# EAGLE design xmega (EAGLE 5.11)
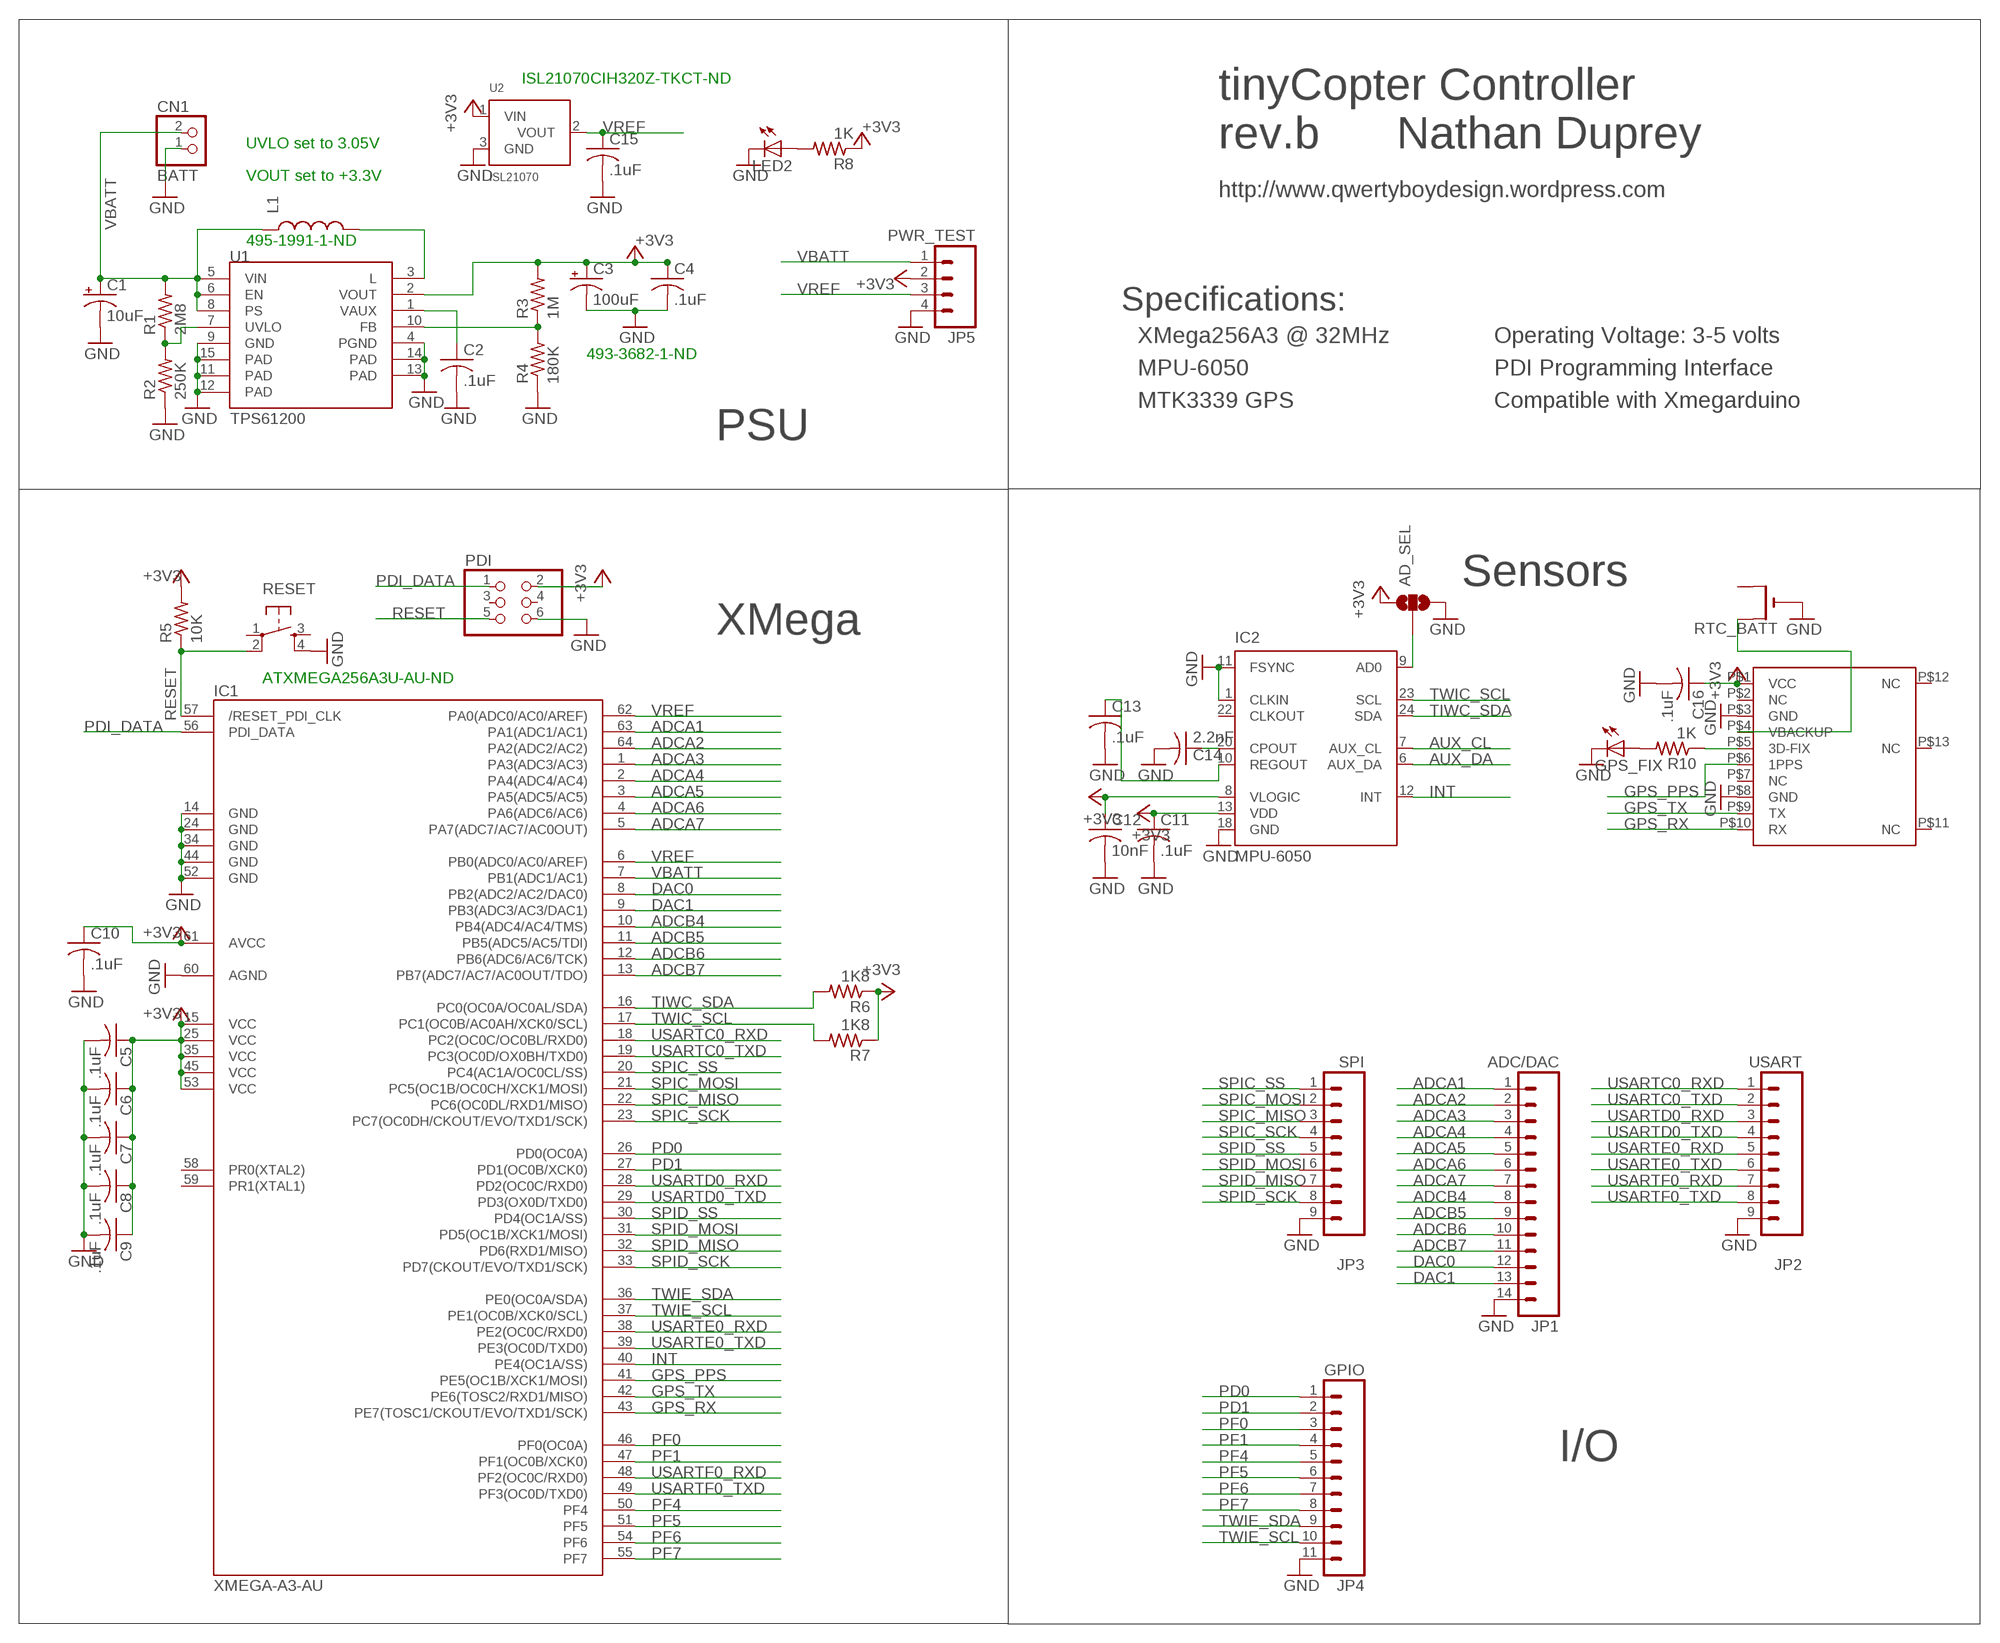
[diagram p0: schematic, sheet 1]

## Parts
AD_SEL  SOLDERJUMPER_2WAY-OLDT  [SJ_2]
C1  10uF  FS_SERIES  [FS_SERIES]
C2  .1uF  C-USC0603  [C0603]
C3  100uF  FS_SERIES  [FS_SERIES]
C4  .1uF  C-USC0603  [C0603]
C5  .1uF  C-USC0603  [C0603]
C6  .1uF  C-USC0603  [C0603]
C7  .1uF  C-USC0603  [C0603]
C8  .1uF  C-USC0603  [C0603]
C9  .1uF  C-USC0603  [C0603]
C10  .1uF  C-USC0603  [C0603]
C11  .1uF  C-USC0603  [C0603]
C12  10nF  C-USC0603  [C0603]
C13  .1uF  C-USC0603  [C0603]
C14  2.2nF  C-USC0603  [C0603]
C15  .1uF  C-USC0603  [C0603]
C16  .1uF  C-USC0603  [C0603]
CN1  BATT  JST_2PIN-THM  [JST-PH-2-THM]
GPS  GPS_FGPMMOPA6C  [FGPMMOPA6C]
GPS_FIX  LEDCHIPLED_0805  [CHIPLED_0805]
IC1  XMEGA-A3-AU  [TQFP64_14X14MM]
IC2  MPU-6050  [QFN-24]
JP1  ADC/DAC  M14LOCK  [1X14_LOCK]
JP2  USART  M09LOCK  [1X09_LOCK]
JP3  SPI  M09LOCK  [1X09_LOCK]
JP4  GPIO  M11LOCK  [1X11_LOCK]
JP5  PWR_TEST  M04LOCK  [1X04_LOCK]
L1  INDUCTOR-B82462G  [B82462G]
LED2  LEDCHIPLED_0805  [CHIPLED_0805]
PDI  PINHD-2X3  [2X03]
R1  2M8  R-US_R0603  [R0603]
R2  250K  R-US_R0603  [R0603]
R3  1M  R-US_R0603  [R0603]
R4  180K  R-US_R0603  [R0603]
R5  10K  R-US_R0603  [R0603]
R6  1K8  R-US_R0603  [R0603]
R7  1K8  R-US_R0603  [R0603]
R8  1K  R-US_R0603  [R0603]
R10  1K  R-US_R0603  [R0603]
RESET  TAC_SWITCHSMD  [TACTILE_SWITCH_SMD]
RTC_BATT  CR1220SMT  [CR1220-SMD]
U1  TPS61200  [QFN-10_PAD]
U2  ISL21070  [SOT-23]

## Nets
+3V3: AD_SEL.1 C3.+ C4.1 C5.1 C6.1 C7.1 C8.1 C9.1 C10.1 C11.1 C12.1 C16.1 GPS.P$1(VCC) IC1.15(VCC1) IC1.25(VCC2) IC1.35(VCC3) IC1.45(VCC4) IC1.53(VCC5) IC1.61(AVCC) IC2.8(VLOGIC) IC2.13(VDD) JP5.2 PDI.2 R3.2 R5.2 R6.1 R7.1 R8.1 U1.2(VOUT) U2.1(VIN)
ADCA1: IC1.63(PA1(ADC1/AC1)) JP1.1
ADCA2: IC1.64(PA2(ADC2/AC2)) JP1.2
ADCA3: IC1.1(PA3(ADC3/AC3)) JP1.3
ADCA4: IC1.2(PA4(ADC4/AC4)) JP1.4
ADCA5: IC1.3(PA5(ADC5/AC5)) JP1.5
ADCA6: IC1.4(PA6(ADC6/AC6)) JP1.6
ADCA7: IC1.5(PA7(ADC7/AC7/AC0OUT)) JP1.7
ADCB4: IC1.10(PB4(ADC4/AC4/TMS)) JP1.8
ADCB5: IC1.11(PB5(ADC5/AC5/TDI)) JP1.9
ADCB6: IC1.12(PB6(ADC6/AC6/TCK)) JP1.10
ADCB7: IC1.13(PB7(ADC7/AC7/AC0OUT/TDO)) JP1.11
AUX_CL: IC2.7(AUX_CL)
AUX_DA: IC2.6(AUX_DA)
DAC0: IC1.8(PB2(ADC2/AC2/DAC0)) JP1.12
DAC1: IC1.9(PB3(ADC3/AC3/DAC1)) JP1.13
GND: AD_SEL.3 C1.- C2.2 C3.- C4.2 C5.2 C6.2 C7.2 C8.2 C9.2 C10.2 C11.2 C12.2 C13.2 C14.2 C15.2 C16.2 CN1.1 GPS.P$3(GND) GPS.P$8(GND) GPS_FIX.C IC1.14(GND1) IC1.24(GND2) IC1.34(GND3) IC1.44(GND4) IC1.52(GND5) IC1.60(AGND) IC2.1(CLKIN) IC2.11(FSYNC) IC2.18(GND) JP1.14 JP2.9 JP3.9 JP4.11 JP5.4 LED2.C PDI.6 R2.1 R4.1 RESET.4 RTC_BATT.- U1.4(PGND) U1.9(GND) U1.11(PAD) U1.12(PAD) U1.13(PAD) U1.14(PAD) U1.15(PAD) U2.3(GND)
GPS_PPS: GPS.P$6(1PPS) IC1.41(PE5(OC1B/XCK1/MOSI))
GPS_RX: GPS.P$10(RX) IC1.43(PE7(TOSC1/CKOUT/EVO/TXD1/SCK))
GPS_TX: GPS.P$9(TX) IC1.42(PE6(TOSC2/RXD1/MISO))
INT: IC1.40(PE4(OC1A/SS)) IC2.12(INT)
N$1: L1.P$2 U1.3(L)
N$2: R1.1 R2.2 U1.7(UVLO)
N$3: C2.1 U1.1(VAUX)
N$4: R3.1 R4.2 U1.10(FB)
N$5: GPS.P$5(3D-FIX) R10.1
N$6: AD_SEL.2 IC2.9(AD0)
N$7: GPS_FIX.A R10.2
N$8: LED2.A R8.2
N$9: C14.1 IC2.20(CPOUT)
N$10: C13.1 IC2.10(REGOUT)
N$11: GPS.P$4(VBACKUP) RTC_BATT.+$1(+)
PD0: IC1.26(PD0(OC0A)) JP4.1
PD1: IC1.27(PD1(OC0B/XCK0)) JP4.2
PDI_DATA: IC1.56(PDI_DATA) PDI.1
PF0: IC1.46(PF0(OC0A)) JP4.3
PF1: IC1.47(PF1(OC0B/XCK0)) JP4.4
PF4: IC1.50(PF4) JP4.5
PF5: IC1.51(PF5) JP4.6
PF6: IC1.54(PF6) JP4.7
PF7: IC1.55(PF7) JP4.8
RESET: IC1.57(/RESET_PDI_CLK) PDI.5 R5.1 RESET.2
SPIC_MISO: IC1.22(PC6(OC0DL/RXD1/MISO)) JP3.3
SPIC_MOSI: IC1.21(PC5(OC1B/OC0CH/XCK1/MOSI)) JP3.2
SPIC_SCK: IC1.23(PC7(OC0DH/CKOUT/EVO/TXD1/SCK)) JP3.4
SPIC_SS: IC1.20(PC4(AC1A/OC0CL/SS)) JP3.1
SPID_MISO: IC1.32(PD6(RXD1/MISO)) JP3.7
SPID_MOSI: IC1.31(PD5(OC1B/XCK1/MOSI)) JP3.6
SPID_SCK: IC1.33(PD7(CKOUT/EVO/TXD1/SCK)) JP3.8
SPID_SS: IC1.30(PD4(OC1A/SS)) JP3.5
TIWC_SDA: IC1.16(PC0(OC0A/OC0AL/SDA)) IC2.24(SDA) R6.2
TWIC_SCL: IC1.17(PC1(OC0B/AC0AH/XCK0/SCL)) IC2.23(SCL) R7.2
TWIE_SCL: IC1.37(PE1(OC0B/XCK0/SCL)) JP4.10
TWIE_SDA: IC1.36(PE0(OC0A/SDA)) JP4.9
USARTC0_RXD: IC1.18(PC2(OC0C/OC0BL/RXD0)) JP2.1
USARTC0_TXD: IC1.19(PC3(OC0D/OX0BH/TXD0)) JP2.2
USARTD0_RXD: IC1.28(PD2(OC0C/RXD0)) JP2.3
USARTD0_TXD: IC1.29(PD3(OX0D/TXD0)) JP2.4
USARTE0_RXD: IC1.38(PE2(OC0C/RXD0)) JP2.5
USARTE0_TXD: IC1.39(PE3(OC0D/TXD0)) JP2.6
USARTF0_RXD: IC1.48(PF2(OC0C/RXD0)) JP2.7
USARTF0_TXD: IC1.49(PF3(OC0D/TXD0)) JP2.8
VBATT: C1.+ CN1.2 IC1.7(PB1(ADC1/AC1)) JP5.1 L1.P$1 R1.2 U1.5(VIN) U1.6(EN) U1.8(PS)
VREF: C15.1 IC1.6(PB0(ADC0/AC0/AREF)) IC1.62(PA0(ADC0/AC0/AREF)) JP5.3 U2.2(VOUT)
Unconnected: GPS.P$2(NC) GPS.P$7(NC) GPS.P$11(NC) GPS.P$12(NC) GPS.P$13(NC) IC1.58(PR0(XTAL2)) IC1.59(PR1(XTAL1)) IC2.22(CLKOUT) PDI.3 PDI.4 RESET.1 RESET.3 RTC_BATT.+$2(+1)

## Notes on the sheet
- ISL21070CIH320Z-TKCT-ND
- tinyCopter Controller
- UVLO set to 3.05V | rev.b | Nathan Duprey
- VOUT set to +3.3V
- http://www.qwertyboydesign.wordpress.com
- 495-1991-1-ND
- Specifications:
- XMega256A3 @ 32MHz | Operating Voltage: 3-5 volts
- 493-3682-1-ND
- MPU-6050 | PDI Programming Interface
- MTK3339 GPS | Compatible with Xmegarduino
- PSU
- Sensors
- XMega
- ATXMEGA256A3U-AU-ND
- I/O

## Library data of the parts
AD_SEL = SparkFun:SOLDERJUMPER_2WAY-OLD: Solder Jumper 2 way solder jumper
C1 C3 = adafruit:FS_SERIES
C2 C4-C16 = adafruit:C-US: CAPACITOR, American symbol
CN1 = adafruit:JST_2PIN: JST 2-Pin Connectors of various flavors SMT-RA (S2B-PH-SM4) 4UConnector #17311 SMT (B2B-PH-SM4) THM-RA (S2B-PH) THM (B2B-PH)
GPS = adafruit:GPS_FGPMMOPA6C: FGPMMOPA6C 16x16 GPS Module NMEA Sentences: GGA, GSA, GSV, RMC, VTG
GPS_FIX LED2 = adafruit:LED: LED OSRAM: - CHIPLED LG R971, LG N971, LY N971, LG Q971, LY Q971, LO R971, LY R971 LH N974, LH R974 LS Q976, LO Q976, LY Q976 LO Q996 - Hyper CHIPLED LW Q18S LB Q993, LB Q99A, LB R99A - SideLED LS A670, LO A670, LY A670, LG A670, LP A670 LB A673, LV A673, LT A673, LW A673 LH A674 LY A675 LS A676, LA A676, LO A676, LY A676, LW A676 LS A679, LY A679, LG A679 - Hyper Micro SIDELED® LS Y876, LA Y876, LO Y876, LY Y876 LT Y87S - SmartLED LW L88C, LW L88S LB L89C, LB L89S, LG L890 LS L89K, LO L89K, LY L89K LS L896, LA L896, LO L896, LY L896 - TOPLED LS T670, LO T670, LY T670, LG T670, LP T670 LSG T670, LSP T670, LSY T670, LOP T670, LYG T670 LG T671, LOG T671, LSG T671 LB T673, LV T673, LT T673, LW T673 LH T674 LS T676, LA T676, LO T676, LY T676, LB T676, LH T676, LSB T676, LW T676 LB T67C, LV T67C, LT T67C, LS T67K, LO T67K, LY T67K, LW E67C LS E67B, LA E67B, LO E67B, LY E67B, LB E67C, LV E67C, LT E67C LW T67C LS T679, LY T679, LG T679 LS T770, LO T770, LY T770, LG T770, LP T770 LB T773, LV T773, LT T773, LW T773 LH T774 LS E675, LA E675, LY E675, LS T675 LS T776, LA T776, LO T776, LY T776, LB T776 LHGB T686 LT T68C, LB T68C - Hyper Mini TOPLED® LB M676 - Mini TOPLED Santana® LG M470 LS M47K, LO M47K, LY M47K Source: http://www.osram.convergy.de/
IC1 = SparkFun:XMEGA-A3: Atmel's 8/16-bit AVR XMEGA A3 Microcontroller - ATxmega256A3, etc.
IC2 = InvenSense:MPU-6050: MPU-6050 The MPU-60X0 has an embedded 3-axis MEMS gyroscope, a 3-axis MEMS accelerometer, and a Digital Motion Processor? (DMP?) hardware accelerator engine with an auxiliary I2C port that interfaces to 3rd party digital sensors such as magnetometers. Source: MPU-60X0 Product Specification <http://dlnmh9ip6v2uc.cloudfront.net/datasheets/Components/General%20IC/PS-MPU-6000A.pdf>
JP1 = SparkFun:M14: Header 14 Standard 14-pin 0.1" header. Use with straight break away headers (SKU : PRT-00116), right angle break away headers (PRT-00553), swiss pins (PRT-00743), machine pins (PRT-00117), and female headers (PRT-00115).
JP2 JP3 = SparkFun:M09: Header 9 Standard 9-pin 0.1" header. Use with straight break away headers (SKU : PRT-00116), right angle break away headers (PRT-00553), swiss pins (PRT-00743), machine pins (PRT-00117), and female headers (PRT-00115).
JP4 = SparkFun:M11: Header 11 Standard 11-pin 0.1" header. Use with straight break away headers (SKU : PRT-00116), right angle break away headers (PRT-00553), swiss pins (PRT-00743), machine pins (PRT-00117), and female headers (PRT-00115).
JP5 = SparkFun:M04: Header 4 Standard 4-pin 0.1" header. Use with straight break away headers (SKU : PRT-00116), right angle break away headers (PRT-00553), swiss pins (PRT-00743), machine pins (PRT-00117), and female headers (PRT-00115). Molex polarized connector foot print use with SKU : PRT-08231 with associated crimp pins and housings. 1MM SMD Version SKU: PRT-10208
L1 = SparkFun:INDUCTOR: Inductors Basic Inductor/Choke - 0603 and 1206. Footprints are not proven and vary greatly between part numbers.
PDI = SparkFun:PINHD-2X3: PIN HEADER
R1-R8 R10 = adafruit:R-US_: RESISTOR, American symbol
RESET = SparkFun:TAC_SWITCH: Momentary Switch Button commonly used for reset or general input. Spark Fun Electronics SKU : COM-00097
RTC_BATT = adafruit:CR1220: CR1216/CR1220/CR1225 12mm 3V lithium coin cell Great for battery packup. Both SMT and THM holders. Note the THM package has the ground pads on both sides of the PCB so that the masks are the same - this reduces the cost
U1 = SparkFun:TPS61200: DC to DC Booster
U2 = intersil:ISL21070

## Board
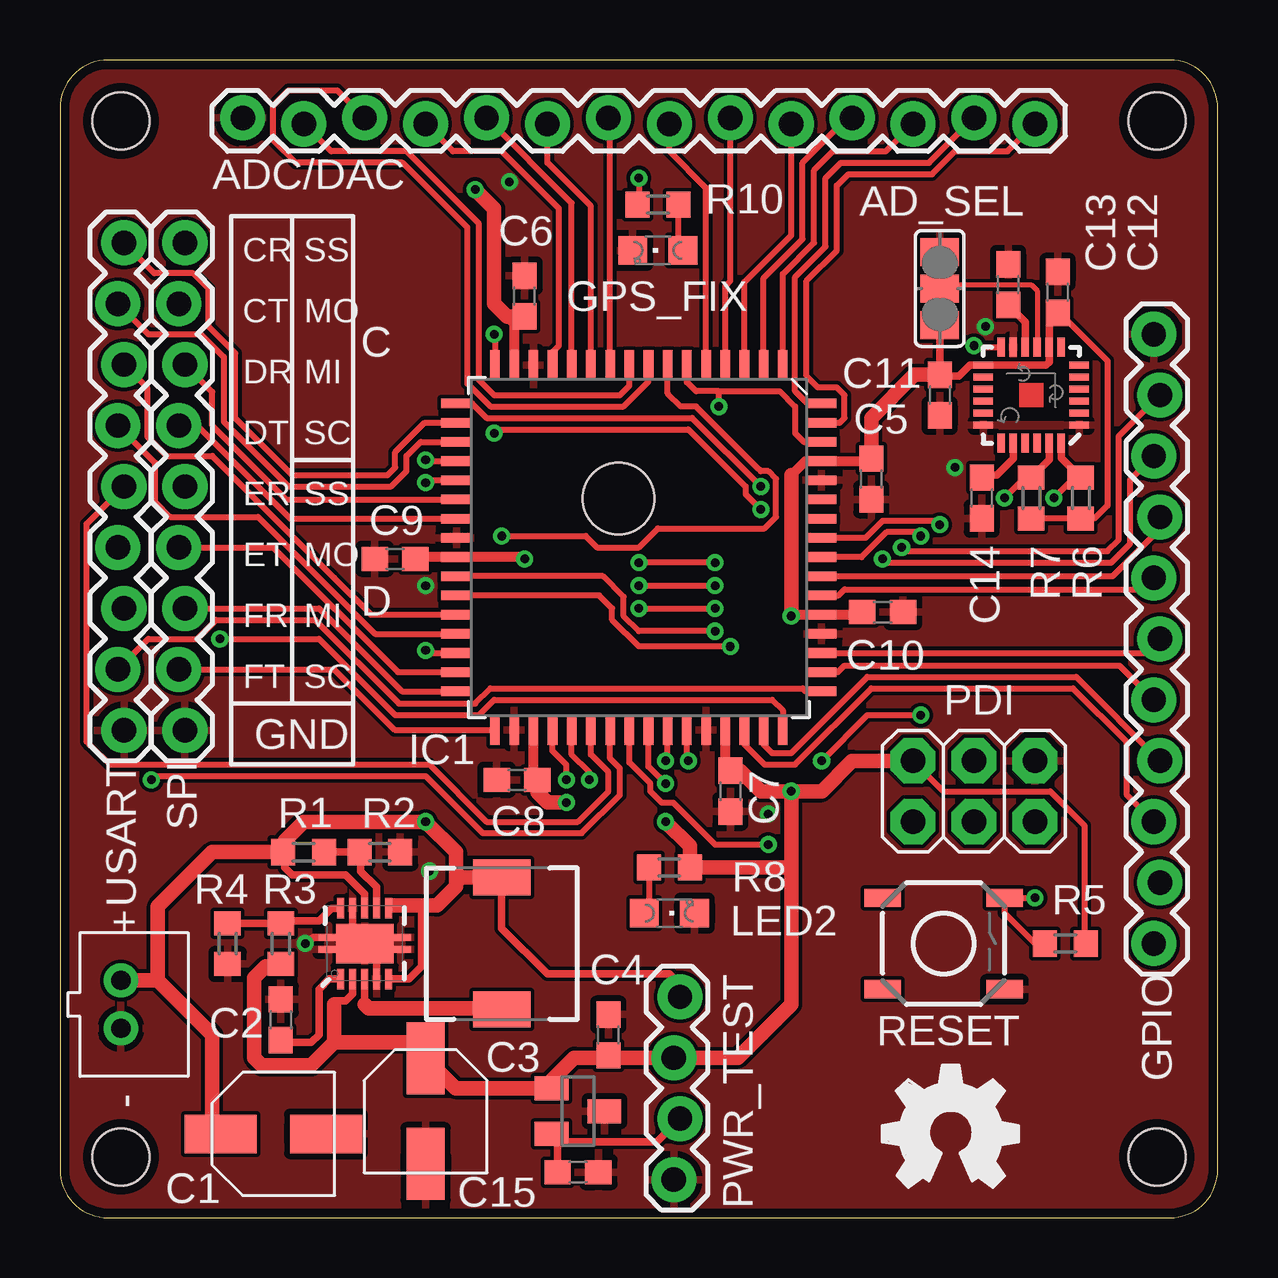
[diagram p1: board, top side]
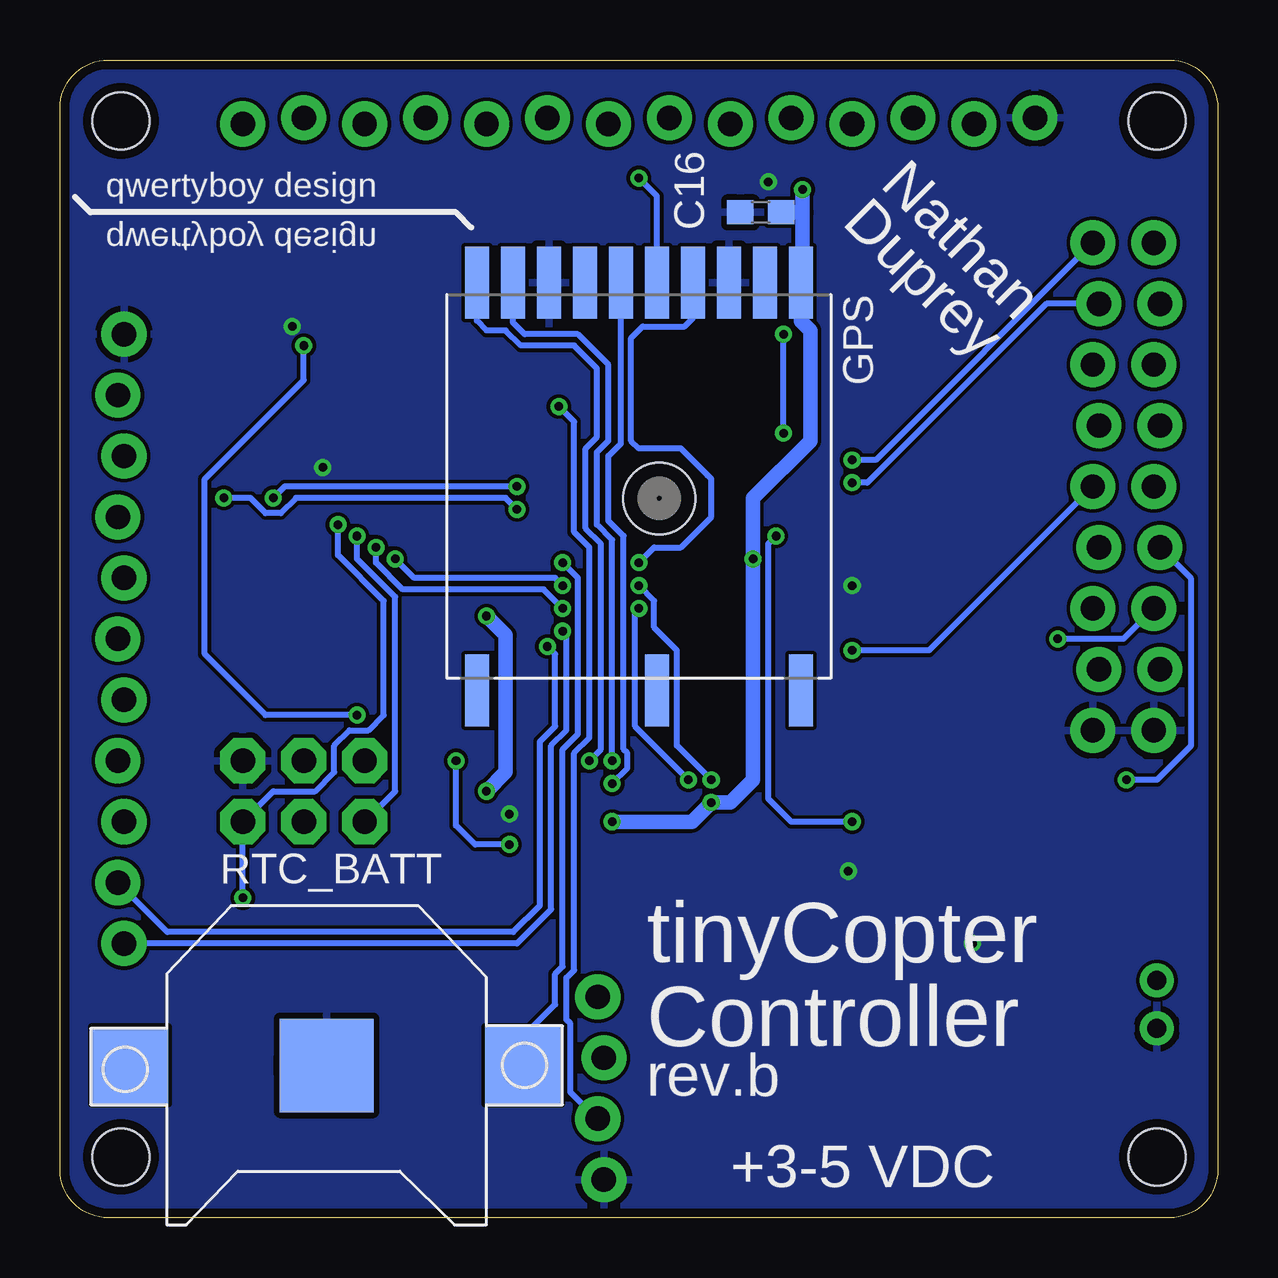
[diagram p2: board, bottom side, seen from below]

Size 48.26 x 48.26 mm. Coordinates in mm from the lower left corner, seen from the top.
Outline: 2,48.26 arc90 0,46.26 0,2 arc90 2,0 46.26,0 arc90 48.26,2 48.26,46.26 arc90 46.26,48.26 2,48.26
Copper layers (1*16): Top 0.0356mm / dielectric 1.5011mm / Bottom 0.0356mm
Design rules "LaenPCBOrder *": minimum track width 6mil, minimum drill 13mil, track to track 6mil, track to pad 6mil, pad to pad 6mil, via to via 6mil, smd to smd 6mil, copper to edge 15mil, drill to drill 6mil, minimum pad ring 7mil, minimum via ring 7mil, stop-mask expansion 4mil, vias tented up to drill 15mil, thermal gap 10mil
Holes 2.38 mm at 2.54,2.54 45.72,2.54 2.54,45.72 45.72,45.72
tRestrict: 46 lines
bRestrict: 15 lines

### Footprints (pad centres in the part's own frame; a part is rotated, then mirrored left to right if it is on the bottom)
SJ_2 = smd 1.168 x 1.6: 1 -1.524,0; 2 0,0; 3 1.524,0
FS_SERIES = smd 3 x 1.6: + 2.2,0; - -2.2,0
C0603 = smd 1.1 x 1: 1 -0.85,0; 2 0.85,0
JST-PH-2-THM = drill 0.8 pad 1.422 round: 1 1,0; 2 -1,0
FGPMMOPA6C = smd 3 x 1: P$1 -8.5,6.75; P$2 -8.5,5.25; P$3 -8.5,3.75; P$4 -8.5,2.25; P$5 -8.5,0.75; P$6 -8.5,-0.75; P$7 -8.5,-2.25; P$8 -8.5,-3.75; P$9 -8.5,-5.25; P$10 -8.5,-6.75; P$11 8.5,-6.75; P$12 8.5,0.75; P$13 8.5,6.75 | hole 3: 0.5,0.85
CHIPLED_0805 = smd 1.2 x 1.2: A 0,-1.05; C 0,1.05
TQFP64_14X14MM = smd 0.4 x 1.27: 1 -6,-7.6; 2 -5.2,-7.6; 3 -4.4,-7.6; 4 -3.6,-7.6; 5 -2.8,-7.6; 6 -2,-7.6; 7 -1.2,-7.6; 8 -0.4,-7.6; 9 0.4,-7.6; 10 1.2,-7.6; 11 2,-7.6; 12 2.8,-7.6; 13 3.6,-7.6; 14 4.4,-7.6; 15 5.2,-7.6; 16 6,-7.6; 33 6,7.6; 34 5.2,7.6; 35 4.4,7.6; 36 3.6,7.6; 37 2.8,7.6; 38 2,7.6; 39 1.2,7.6; 40 0.4,7.6; 41 -0.4,7.6; 42 -1.2,7.6; 43 -2,7.6; 44 -2.8,7.6; 45 -3.6,7.6; 46 -4.4,7.6; 47 -5.2,7.6; 48 -6,7.6 | smd 1.27 x 0.4: 17 7.6,-6; 18 7.6,-5.2; 19 7.6,-4.4; 20 7.6,-3.6; 21 7.6,-2.8; 22 7.6,-2; 23 7.6,-1.2; 24 7.6,-0.4; 25 7.6,0.4; 26 7.6,1.2; 27 7.6,2; 28 7.6,2.8; 29 7.6,3.6; 30 7.6,4.4; 31 7.6,5.2; 32 7.6,6; 49 -7.6,6; 50 -7.6,5.2; 51 -7.6,4.4; 52 -7.6,3.6; 53 -7.6,2.8; 54 -7.6,2; 55 -7.6,1.2; 56 -7.6,0.4; 57 -7.6,-0.4; 58 -7.6,-1.2; 59 -7.6,-2; 60 -7.6,-2.8; 61 -7.6,-3.6; 62 -7.6,-4.4; 63 -7.6,-5.2; 64 -7.6,-6
QFN-24 = smd 0.8 x 0.3: 1 -2,1.25; 2 -2,0.75; 3 -2,0.25; 4 -2,-0.25; 5 -2,-0.75; 6 -2,-1.25; 13 2,-1.25; 14 2,-0.75; 15 2,-0.25; 16 2,0.25; 17 2,0.75; 18 2,1.25 | smd 0.3 x 0.8: 7 -1.25,-2; 8 -0.75,-2; 9 -0.25,-2; 10 0.25,-2; 11 0.75,-2; 12 1.25,-2; 19 1.25,2; 20 0.75,2; 21 0.25,2; 22 -0.25,2; 23 -0.75,2; 24 -1.25,2
1X14_LOCK = drill 1.016 pad 1.88 round: 1 0,0.127; 2 2.54,-0.127; 3 5.08,0.127; 4 7.62,-0.127; 5 10.16,0.127; 6 12.7,-0.127; 7 15.24,0.127; 8 17.78,-0.127; 9 20.32,0.127; 10 22.86,-0.127; 11 25.4,0.127; 12 27.94,-0.127; 13 30.48,0.127; 14 33.02,-0.127
1X09_LOCK = drill 1.016 pad 1.88 round: 1 0,0.127; 2 2.54,-0.127; 3 5.08,0.127; 4 7.62,-0.127; 5 10.16,0.127; 6 12.7,-0.127; 7 15.24,0.127; 8 17.78,-0.127; 9 20.32,0.127
1X11_LOCK = drill 1.016 pad 1.88 round: 1 0,0.127; 2 2.54,-0.127; 3 5.08,0.127; 4 7.62,-0.127; 5 10.16,0.127; 6 12.7,-0.127; 7 15.24,0.127; 8 17.78,-0.127; 9 20.32,0.127; 10 22.86,-0.127; 11 25.4,0.127
1X04_LOCK = drill 1.016 pad 1.88 round: 1 0,0.127; 2 2.54,-0.127; 3 5.08,0.127; 4 7.62,-0.127
B82462G = smd 2.4 x 1.5: P$1 0,2.75; P$2 0,-2.75
2X03 = drill 1.016 pad 1.88 octagon: 1 -2.54,-1.27; 2 -2.54,1.27; 3 0,-1.27; 4 0,1.27; 5 2.54,-1.27; 6 2.54,1.27
R0603 = smd 1 x 1.1: 1 -0.85,0; 2 0.85,0
TACTILE_SWITCH_SMD = smd 1.524 x 0.762: 1 -2.54,1.905; 2 2.54,1.905; 3 -2.54,-1.905; 4 2.54,-1.905
CR1220-SMD = smd 3.2 x 3.2: +$1 -8.2,0; +$2 8.2,0 | smd 3.9 x 3.9: - 0,0
QFN-10_PAD = smd 0.297 x 0.85: 1 -1,-1.475; 2 -0.5,-1.475; 3 0,-1.475; 4 0.5,-1.475; 5 1,-1.475; 6 1,1.475; 7 0.5,1.475; 8 0,1.475; 9 -0.5,1.475; 10 -1,1.475 | smd 0.85 x 0.297: 11 -1.5,0.25; 12 -1.5,-0.25; 13 1.5,0.25; 14 1.5,-0.25 | smd 2.4 x 1.65: 15 0,0
SOT-23 = smd 1 x 1.4: 1 -0.95,-1.1; 2 0.95,-1.1; 3 0,1.1

### Placement (x,y rotation side)
AD_SEL  36.67,38.73 90 top
C1  8.89,3.49 180 top
C2  9.21,8.26 90 top
C3  15.24,4.45 90 top
C4  22.86,7.62 90 top
C5  33.81,30.8 270 top
C6  19.37,38.42 90 top
C7  27.94,17.78 270 top
C8  19.05,18.26 180 top
C9  13.97,27.46 180 top
C10  34.29,25.24 0 top
C11  36.67,34.29 270 top
C12  41.59,38.58 90 top
C13  39.53,38.89 90 top
C14  38.42,30 270 top
C15  21.59,1.91 0 top
C16  19.05,41.91 180 bottom
CN1  2.54,8.89 270 top
GPS  24.13,30.48 270 bottom
GPS_FIX  24.92,40.32 90 top
IC1  24.13,27.94 180 top
IC2  40.48,34.29 180 top
JP1  40.64,45.72 180 top
JP2  2.54,40.64 270 top
JP3  5.08,40.64 270 top
JP4  45.72,11.43 90 top
JP5  25.72,9.21 270 top
L1  18.41,11.43 0 top
LED2  25.4,12.7 270 top
PDI  38.1,17.78 0 top
R1  10.16,15.24 180 top
R2  13.34,15.24 180 top
R3  9.21,11.43 270 top
R4  6.99,11.43 90 top
R5  41.91,11.43 0 top
R6  42.55,30 90 top
R7  40.48,30 90 top
R8  25.4,14.61 180 top
R10  24.92,42.23 0 top
RESET  36.83,11.43 0 top
RTC_BATT  37.15,6.35 180 bottom
U1  12.7,11.43 0 top
U2  21.59,4.45 270 top
U$1  [QWERTYBOY_DESIGN_LOGO]  39.37,41.91 0 top
U$2  [OSHW_FILLX200_NOTEXT]  34.29,1.27 0 top

### Tracks (layer width: path | path; a pad name or v marks a point on that pad's centre or on a via)
+3V3  (via drill 0.36)
  Top 0.254: R7.1 R6.1 43.12,29.15 43.66,29.69 43.66,35.72 41.75,37.62 41.7,37.62 C12.1 | PDI.2 | PDI.2 36.83,17.78 41.27,17.78 42.7,16.35 42.7,11.49 R5.2
  Top 0.305: U1.2 12.2,9.34 11.91,9.05 11.43,9.05 11.43,8.89 | C12.1 41.23,37.37 IC2.8 41.23,35.67 41.1,35.54 IC2.13 37.92,35.54 37.47,35.08 36.73,35.08 C11.1 AD_SEL.1 | AD_SEL.1
  Top 0.406: C9.1 14.9,27.54 IC1.25 19.29,27.54 v19.37,27.46 | C5.1 33.71,31.54 IC1.61 31.06,31.54 30.48,30.96 | C10.1 33.34,25.14 IC1.53 30.54,25.14 v30.48,25.08 | IC1.15 18.93,37.27 18.63,37.57 | IC1.45 27.73,19 C7.1 | IC1.35 19.73,18.43 C8.1
  Top 0.61: 11.43,7.3 11.43,8.89 | 11.43,7.3 10.48,6.35 8.41,6.35 8.1,6.67 8.1,10 8.57,10.48 9.11,10.48 R3.2 | 11.43,7.3 14.58,7.3 C3.+ | C3.+ 15.24,5.87 15.56,5.56 | C3.+ 16.49,5.4 U2.1 20.49,5.73 21.43,6.67 22.76,6.67 C4.1 22.96,6.67 JP5.2 28.26,6.67 30.48,8.89 30.48,14.61 | C6.1 18.63,37.57 18.1,38.1 18.1,42.07 v17.3,42.86 | 30.48,14.61 v30.48,17.78 | PDI.2 33.02,19.05 31.75,17.78 v30.48,17.78 | v30.48,17.78 29.21,17.78 28.36,18.63 C7.1 | 30.48,14.61 R8.1 26.25,15.5 v25.24,16.51 | C8.1 19.9,17.72 20.32,17.3 v21.11,17.3 | C5.1 33.81,33.34 35.62,35.14 C11.1 | v30.48,25.08 30.48,30.96
  Bottom 0.61: 17.3,41.91 17.3,39.76 17.38,39.69 GPS.P$1 17.38,37.38 16.99,36.99 16.99,32.38 19.37,30 v19.37,27.46 19.37,18.26 20.32,17.3 v21.11,17.3 21.91,16.51 v25.24,16.51 | 17.3,41.91 v17.3,42.86 | 17.3,41.91 C16.1 | v30.48,25.08 29.69,24.29 29.69,18.57 v30.48,17.78
ADCA1
  Top 0.254: IC1.63 32.51,33.14 32.7,33.34 32.7,34.29 32.38,34.61 31.59,34.61 31.11,35.08 31.11,39.05 32.38,40.32 32.38,43.02 32.86,43.5 36.35,43.5 37.31,44.45 39.5,44.45 JP1.1
ADCA2
  Top 0.254: IC1.64 31.15,33.94 30.64,34.45 30.64,39.21 31.91,40.48 31.91,43.34 32.54,43.97 36.23,43.97 JP1.2
ADCA3
  Top 0.254: IC1.1 30.13,39.34 31.43,40.64 31.43,43.66 | JP1.3 34.42,44.45 32.23,44.45 31.43,43.66 | 31.43,43.66
ADCA4
  Top 0.254: IC1.2 29.33,39.17 30.96,40.8 30.96,43.97 32.83,45.85 JP1.4
ADCA5
  Top 0.254: IC1.3 28.53,39.01 30.48,40.96 JP1.5
ADCA6
  Top 0.254: IC1.4 27.73,38.84 27.94,39.05 JP1.6
ADCA7
  Top 0.254: JP1.7 25.4,44.45 26.93,42.92 IC1.5
ADCB4
  Top 0.254: IC1.10 22.93,45.78 JP1.8
ADCB5
  Top 0.254: IC1.11 22.13,42.16 20.32,43.97 JP1.9
ADCB6
  Top 0.254: IC1.12 21.33,42.3 JP1.10
ADCB7
  Top 0.254: JP1.11 16.38,44.45 18.41,44.45 20.8,42.07 20.8,36.35 20.53,36.09 IC1.13
DAC0
  Top 0.254: IC1.8 24.53,34.85 23.5,33.81 17.94,33.81 16.99,34.77 16.99,41.27 14.29,43.97 9.84,43.97 8.89,44.93 8.89,46.35 9.53,46.99 11.56,46.99 JP1.12
DAC1
  Top 0.254: IC1.9 23.73,34.68 23.34,34.29 18.1,34.29 17.46,34.92 17.46,41.43 14.45,44.45 11.3,44.45 JP1.13
GND  (via drill 0.36)
  Top 0.305: U1.4 13.2,10.93 U1.15 | U1.14 12.95,11.18 U1.15 | U1.15 12.45,11.68 U1.11 10.57,11.68 v10.22,11.43 | U1.9 12.2,11.93 U1.15
  other vias: 15.4,14.45 18.73,43.18 38.58,37.15 37.31,31.27 15.24,26.35 29.53,16.83
  pour Top (isolate 0.152): 0,0 48.26,0 48.26,48.26 0,48.26
  pour Bottom (isolate 0.152): 0,0 48.26,0 48.26,48.26 0,48.26
GPS_PPS  (via drill 0.36)
  Top 0.254: IC1.41 24.53,18.81 v25.24,18.1
  Bottom 0.254: GPS.P$6 24.88,32.27 25.4,31.75 25.4,29.05 24.77,28.42 24.77,19.53 | 24.77,19.53 | v25.24,18.1 24.61,18.73 24.61,19.37 24.77,19.53
GPS_RX  (via drill 0.36)
  Top 0.254: IC1.43 26.13,19.11 v26.19,19.05
  Bottom 0.254: v26.19,19.05 25.72,19.53 25.72,28.1 26.35,28.73 26.35,32.07 25.88,32.54 25.88,35.4 26.83,36.35 29.05,36.35 29.69,36.99 30.48,36.99 30.88,37.39 GPS.P$10
GPS_TX  (via drill 0.36)
  Top 0.254: IC1.42 25.33,19.12 v25.24,19.05
  Bottom 0.254: GPS.P$9 29.38,37.32 28.89,36.83 26.67,36.83 25.4,35.56 25.4,32.38 25.88,31.91 25.88,28.89 25.24,28.26 v25.24,19.05
INT  (via drill 0.36)
  Top 0.254: v35.88,20.95 33.66,20.95 v31.75,19.05 | v29.53,15.56 27.3,15.56 25.56,17.3 25.08,17.3 24.61,17.78 24.61,18.1 23.73,18.97 IC1.40 | IC2.12 38.16,36.29 v38.1,36.35
  Bottom 0.254: v38.1,36.35 38.1,34.92 42.23,30.8 42.23,23.5 39.69,20.95 v35.88,20.95 | v31.75,19.05 31.75,16.35 30.96,15.56 v29.53,15.56
N$1
  Top 0.305: U1.3 12.7,8.89
  Top 0.61: 12.7,8.89 12.86,8.73 18.36,8.73 L1.P$2 18.31,8.57
N$2
  Top 0.305: R1.1 R2.2 12.54,15.18 12.54,14.45 13.2,13.79 U1.7
N$3
  Top 0.305: U1.1 11.22,9.96 10.79,9.53 10.79,7.62 10.48,7.3 9.31,7.3 C2.1
N$4
  Top 0.305: R4.2 R3.1 9.31,12.38 10.79,12.38 11.32,12.9 U1.10
N$5  (via drill 0.36)
  Top 0.254: v24.13,43.34 24.13,42.28 R10.1
  Bottom 0.254: GPS.P$5 23.38,42.59 v24.13,43.34
N$6
  Top 0.203: IC2.9 40.73,38.64 40.48,38.89 36.67,38.89 AD_SEL.2
N$7
  Top 0.254: R10.2 25.77,40.52 GPS_FIX.A
N$8
  Top 0.254: R8.2 24.55,12.9 LED2.A
N$9
  Top 0.305: IC2.20 39.73,31.64 39.05,30.96 38.52,30.96 C14.1
N$10
  Top 0.305: IC2.10 40.23,37.34 C13.1
N$11  (via drill 0.36)
  Top 0.254: v27.3,27.3 v24.13,27.3
  Bottom 0.254: RTC_BATT.+$1 28.95,7.57 27.62,8.89 27.62,10.16 27.3,10.48 27.3,19.53 26.67,20.16 26.67,26.67 v27.3,27.3 | GPS.P$4 21.88,37.49 22.23,37.15 23.97,37.15 24.45,36.67 24.45,32.38 24.13,32.07 22.38,32.07 21.27,30.96 | 21.27,30.96 | 21.27,30.96 21.11,30.8 21.11,29.21 22.38,27.94 23.5,27.94 v24.13,27.3
PD0  (via drill 0.36)
  Top 0.254: IC1.26 22.63,26.74 23.5,25.88 23.5,25.08 24.13,24.45 v27.3,24.45
  Bottom 0.254: JP4.1 29.21,11.43 27.78,12.86 27.78,19.68 27.15,20.32 27.15,24.29 v27.3,24.45
PD1  (via drill 0.36)
  Top 0.254: IC1.27 22.48,25.94 23.02,25.4 23.02,24.92 24.13,23.81 v27.94,23.81
  Bottom 0.254: JP4.2 43.78,11.91 29.37,11.91 28.26,13.02 28.26,19.84 27.62,20.48 27.62,23.5 v27.94,23.81
PDI_DATA  (via drill 0.36)
  Top 0.254: IC1.56 33.41,27.54 34.45,28.57 35.72,28.57 v35.88,28.42
  Bottom 0.254: v35.88,28.42 35.88,27.46 34.29,25.88 34.29,17.78 PDI.1
PF0
  Top 0.254: IC1.46 28.53,19.73 29.37,18.89 30.64,18.89 33.81,22.07 42.23,22.07 44.45,19.84 44.45,17.65 JP4.3
PF1
  Top 0.254: IC1.47 29.33,19.72 29.69,19.37 30.48,19.37 33.66,22.54 42.35,22.54 JP4.4
PF4
  Top 0.254: IC1.50 32.42,22.74 32.7,23.02 44.16,23.02 JP4.5
PF5
  Top 0.254: IC1.51 45.26,23.54 JP4.6
PF6
  Top 0.254: IC1.54 32.45,25.94 | JP4.7 45.12,26.19 32.7,26.19 32.45,25.94 | 32.45,25.94
PF7
  Top 0.254: IC1.55 43.88,26.74 45.85,28.7 JP4.8
RESET  (via drill 0.36)
  Top 0.254: IC1.57 33.58,28.34 34.29,29.05 36.51,29.05 v36.67,28.89 | R5.1 40.64,11.43 39.37,12.7 RESET.2 v40.64,13.34
  Bottom 0.254: v36.67,28.89 36.67,27.62 34.77,25.72 34.77,20.95 35.4,20.32 36.2,20.32 36.83,19.68 36.83,18.57 37.62,17.78 39.37,17.78 PDI.5 v40.64,13.34
SPIC_MISO
  Top 0.254: IC1.22 9.43,29.94 6.35,33.02 6.35,34.42 JP3.3
SPIC_MOSI  (via drill 0.36)
  Top 0.254: IC1.21 15.34,30.74 v15.24,30.64
  Bottom 0.254: v15.24,30.64 14.61,30.64 7.14,38.1 JP3.2
SPIC_SCK
  Top 0.254: IC1.23 9.6,29.14 5.71,33.02 JP3.4
SPIC_SS  (via drill 0.36)
  Top 0.254: IC1.20 15.29,31.54 v15.24,31.59
  Bottom 0.254: v15.24,31.59 14.26,31.59 JP3.1
SPID_MISO
  Top 0.254: IC1.32 14.26,21.94 10.79,25.4 | 10.79,25.4 | JP3.7 10.79,25.4 | JP3.7
SPID_MOSI
  Top 0.254: IC1.31 14.09,22.74 8.89,27.94 JP3.6
SPID_SCK
  Top 0.254: IC1.33 13.95,20.34 11.43,22.86 JP3.8
SPID_SS  (via drill 0.36)
  Top 0.254: IC1.30 15.35,23.54 v15.24,23.65
  Bottom 0.254: v15.24,23.65 12.03,23.65 JP3.5
TIWC_SDA  (via drill 0.36)
  Top 0.254: IC1.16 18.13,36.8 v18.1,36.83 | v18.1,32.7 18.26,32.86 26.19,32.86 28.57,30.48 28.57,30.16 v29.21,29.53 | R6.2 42.28,30.85 v41.43,30
  Top 0.305: IC2.24 41.73,31.67 R6.2
  Bottom 0.254: v18.1,32.7 v18.1,36.83 | v29.21,29.53 29.69,30 38.42,30 39.05,29.37 39.69,29.37 40.32,30 v41.43,30
TWIC_SCL  (via drill 0.36)
  Top 0.254: IC1.17 17.18,33.94 17.78,33.34 26.35,33.34 v29.21,30.48 | R7.2 40.22,30.85 v39.37,30
  Top 0.305: IC2.23 41.23,31.6 R7.2
  Bottom 0.254: v29.21,30.48 38.89,30.48 v39.37,30
TWIE_SCL  (via drill 0.36)
  Top 0.254: IC1.37 21.33,19.31 22.07,18.57 v22.07,18.26 | v24.13,25.4 v27.3,25.4 | JP4.10 44.13,32.58 44.13,28.26 43.66,27.78 35.24,27.78 v35.08,27.94
  Bottom 0.254: v35.08,27.94 35.08,27.3 33.97,26.19 28.1,26.19 v27.3,25.4 | v22.07,18.26 24.29,20.48 24.29,25.56 v24.13,25.4
TWIE_SDA  (via drill 0.36)
  Top 0.254: IC1.36 20.53,19.46 21.11,18.88 v21.11,18.26 | v24.13,26.35 v27.3,26.35 | v34.29,27.46 34.45,27.3 43.81,27.3 44.61,28.1 44.61,30.77 JP4.9
  Bottom 0.254: v34.29,27.46 33.5,26.67 27.62,26.67 v27.3,26.35 | v21.11,18.26 22.54,19.68 22.54,23.65 23.5,24.61 23.5,25.72 v24.13,26.35
USARTC0_RXD
  Top 0.254: IC1.18 15.2,33.14 13.97,31.91 13.97,31.27 13.65,30.96 9.68,30.96 7.3,33.34 7.3,36.04 6.19,37.15 6.19,38.73 5.56,39.37 3.94,39.37 JP2.1
USARTC0_TXD
  Top 0.254: IC1.19 15.04,32.34 14.45,31.75 14.45,31.11 13.81,30.48 9.53,30.48 6.83,33.18 6.83,35.88 5.87,36.83 3.68,36.83 JP2.2
USARTD0_RXD
  Top 0.254: IC1.28 12.96,25.14 11.43,26.67 | JP2.3 3.65,34.58 3.65,32.54 4.45,31.75 6.35,31.75 8.41,29.69 | 11.43,26.67 | 8.41,29.69 11.43,26.67 | 8.41,29.69
USARTD0_TXD
  Top 0.254: IC1.29 13.12,24.34 10.95,26.51 | 10.95,26.51 | 10.95,26.51 8.26,29.21 4.6,29.21 3.97,29.84 3.97,31.46 JP2.4
USARTE0_RXD
  Top 0.254: IC1.38 22.13,19.3 22.86,18.57 22.86,17.78 21.59,16.51 17.78,16.51 15.4,18.89 | 15.4,18.89 2.06,18.89 1.27,19.68 | 1.27,19.68 | 1.27,19.68 1.11,19.84 1.11,28.92 JP2.5 | 15.4,18.89
USARTE0_TXD  (via drill 0.36)
  Top 0.254: IC1.39 22.93,19.14 23.34,18.73 23.34,17.62 21.75,16.03 17.62,16.03 15.24,18.41 3.97,18.41 v3.81,18.26
  Bottom 0.254: JP2.6 1.11,26.64 1.11,19.68 2.54,18.26 v3.81,18.26
USARTF0_RXD  (via drill 0.36)
  Top 0.254: IC1.48 30.13,21.15 29.69,21.59 18.1,21.59 17.46,20.95 13.97,20.95 10.79,24.13 v6.67,24.13
  Bottom 0.254: JP2.7 3.94,24.13 v6.67,24.13
USARTF0_TXD
  Top 0.254: 14.13,21.43 17.3,21.43 17.94,22.07 30.96,22.07 31.08,21.94 IC1.49 | JP2.8 3.68,24.13 5.71,24.13 6.51,24.92 10.64,24.92 14.13,21.43 | 14.13,21.43
VBATT  (via drill 0.36)
  Top 0.254: 9.37,15.18 9.37,15.24 | v18.41,28.42 21.91,28.42 22.38,27.94 24.13,27.94 24.92,28.73 29.37,28.73 29.84,29.21 29.84,30.8 29.53,31.11 29.21,31.11 29.05,31.27 26.51,33.81 25.88,33.81 25.33,34.36 IC1.7
  Top 0.305: U1.8 12.7,13.49 11.91,14.29 9.68,14.29 9.37,14.61 9.37,15.18 R1.2 | U1.6 13.86,12.9 13.87,13.02 | U1.5 14.56,9.96 15.08,10.48 15.08,13.02 | JP5.1 25.84,9.72 25.4,10.16 20.32,10.16 18.41,12.06 L1.P$1
  Top 0.61: 4.08,9.89 CN1.2 | 4.08,9.89 6.35,7.62 6.35,3.83 C1.+ | 13.87,13.02 15.08,13.02 15.72,13.02 16.51,13.81 16.51,13.97 | 4.08,9.89 4.08,12.97 6.35,15.24 R1.2 | 9.37,15.24 9.37,15.72 10.16,16.51 v15.24,16.51 16.51,15.24 16.51,13.97 | L1.P$1 16.72,14.18 16.51,13.97
  Bottom 0.254: v15.24,16.51 17.78,16.51 18.73,17.46 18.73,28.1 v18.41,28.42
VREF  (via drill 0.36)
  Top 0.254: IC1.62 31,32.34 30.64,32.7 30.64,33.81 30,34.45 27.46,34.45 | IC1.6 26.13,34.83 26.51,34.45 27.46,34.45 | v27.46,33.81 27.46,34.45
  Top 0.305: C15.1 20.74,3.25 | 20.74,3.25 U2.2 | 20.74,3.25 20.89,3.25 20.95,3.17 24.89,3.17 JP5.3
  Bottom 0.254: v27.46,33.81 26.83,33.18 26.83,28.57 26.19,27.94 26.19,20 26.83,19.37 26.83,10.32 27.15,10 27.15,8.26 26.99,8.1 26.99,5.24 26.83,5.08 | JP5.3 25.88,4.13 26.83,5.08 | 26.83,5.08

### Text on the board
tNames: ADC/DAC | CR | SS | CT | MO | C | DR | MI | DT | SC | ER | SS | ET | MO | FR | MI | D | FT | SC | GND | USART | SPI | PWR_TEST | GPIO
bNames: Nathan | Duprey | tinyCopter | Controller | rev.b | +3-5 VDC